# EAGLE schematic adc module (EAGLE 6.1)
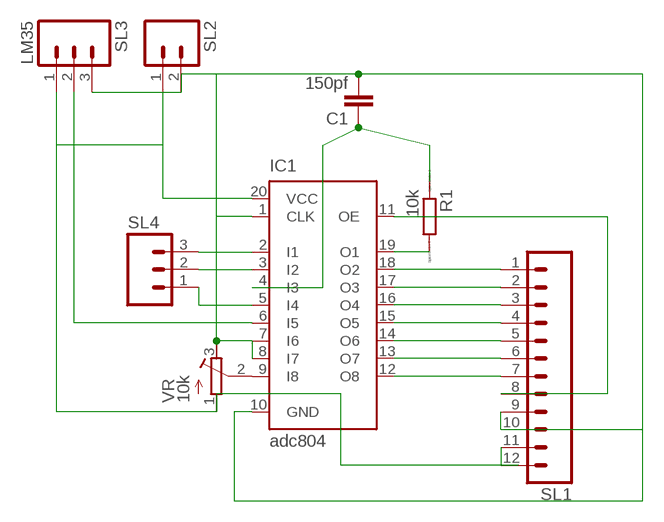
[diagram p0: schematic, sheet 1]

## Parts
C1  150pf  C2,5-3  [C2.5-3]
IC1  adc804  ATF16V8BP3  [DIL20]
R1  10k  R0204/7  [0204/7]
SL1  M12  [12P]
SL2  M02  [02P]
SL3  LM35  M03  [03P]
SL4  M03  [03P]
VR  10k  R-TRIMM64P  [RTRIM64P]

## Nets
N$1: IC1.18(O2) SL1.1
N$2: IC1.17(O3) SL1.2
N$3: IC1.16(O4) SL1.3
N$4: IC1.15(O5) SL1.4
N$5: IC1.14(O6) SL1.5
N$6: IC1.13(O7) SL1.6
N$7: IC1.12(O8) SL1.7
N$8: IC1.11(OE) SL1.8
N$9: IC1.19(O1) R1.2
N$10: C1.1 IC1.4(I3) R1.1
N$12: IC1.2(I1) SL4.3
N$13: IC1.3(I2) SL4.2
N$14: IC1.6(I5) SL3.2
N$15: IC1.5(I4) SL4.1
N$17: IC1.9(I8) VR.2(S)
N$18: C1.2 IC1.1(CLK) IC1.7(I6) IC1.8(I7) IC1.10(GND) SL1.9 SL1.10 SL2.2 SL3.3 VR.3(A)
N$19: IC1.20(VCC) SL1.11 SL2.1 SL3.1 VR.1(E)
Unconnected: SL1.12

## Library data of the parts
C1 = capacitor-wima:C: CAPACITOR naming: grid - package width
IC1 = atmel:ATF16V8B: High perfomance CMOS (electrically erasable) programmable logic device (PLD) ABLE-Atmel-ABEL - P18V8R, P16V8C, P16V8AS, P17V8 COPL Atmel-WinCUPL - G16V8MS, G16V8MA, G16V8AS, G16V8 LOG/IC - GAL16V8_R, GAL16V8_G7, GAL16V8_C), GAL16V8 Tango-PLD - G16V8R, G16V8C, G16V8AS, G16V8 Source: http://www.atmel.com/dyn/resources/prod_documents/DOC0364.PDF; MPN: ATF16V8CZ-15PU; OC_FARNELL: 1551768; OC_NEWARK: 94M6254
R1 = eagle-ltspice:R: RESISTOR, European symbol; SPICEMODEL: NONE; SPICEPREFIX: R
SL1 = con-amp-quick:M12: AMP QUICK CONNECTOR; OC_FARNELL: unknown; OC_NEWARK: unknown
SL2 = con-amp-quick:M02: AMP QUICK CONNECTOR; OC_FARNELL: unknown; OC_NEWARK: unknown
SL3 SL4 = con-amp-quick:M03: AMP QUICK CONNECTOR; OC_FARNELL: unknown; OC_NEWARK: unknown
VR = resistor:R-TRIMM: Trimm resistor